# Altium schematic sheet STM32_CORE.SchDoc
size A4; SheetNumber: 2; SheetTotal: 4
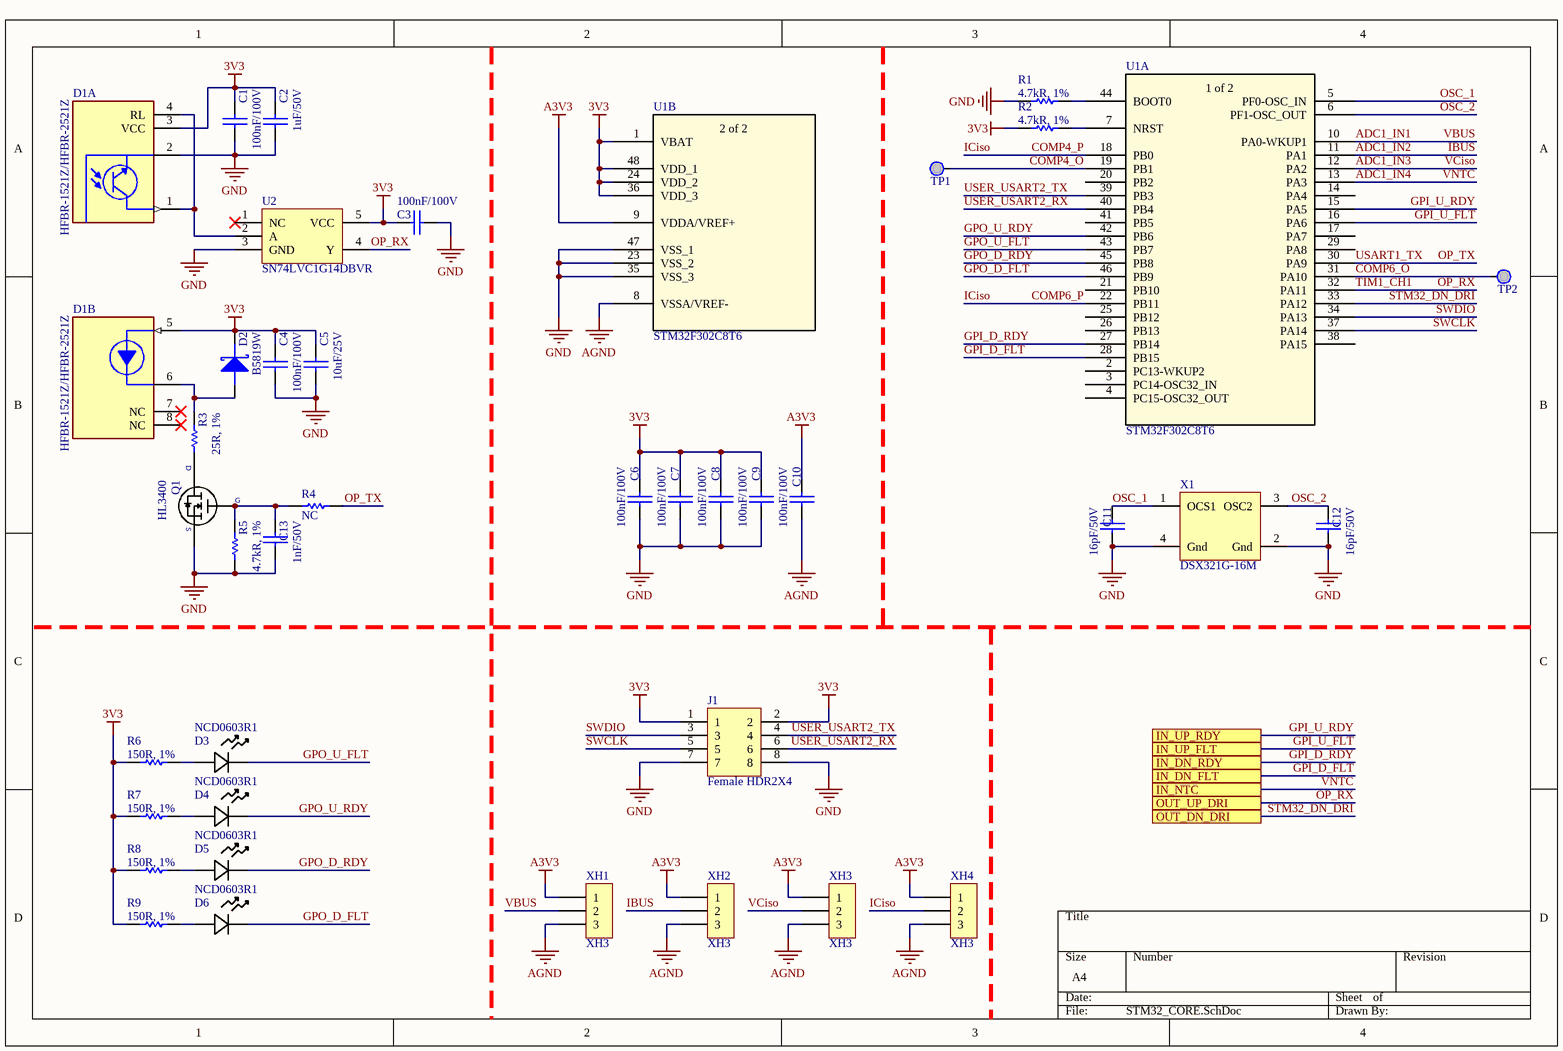
[diagram p0: STM32_CORE.SchDoc]

## Parts
C1  100nF/100V  [0603C]
C2  1uF/50V  [0603C]
C3  100nF/100V  [0603C]
C4  100nF/100V  [0603C]
C5  10uF/25V  [0603C]
C6  100nF/100V  [0603C]
C7  100nF/100V  [0603C]
C8  100nF/100V  [0603C]
C9  100nF/100V  [0603C]
C10  100nF/100V  [0603C]
C11  16pF/50V  [0603C]
C12  16pF/50V  [0603C]
C13  1nF/50V  [0603C]
D1  HFBR-1521Z/HFBR-2521Z  [HFBR_XX21Z_UNION]  (parts A,B of 2)
D2  B5819W  [SOD-123]
D3  NCD0603R1  [LED_LSQ976_OSR]
D4  NCD0603R1  [LED_LSQ976_OSR]
D5  NCD0603R1  [LED_LSQ976_OSR]
D6  NCD0603R1  [LED_LSQ976_OSR]
J1  Female HDR2X4  [Fe-HDR2X4/2.54-S]
Q1  HL3400  [SOT23-3]
R1  4.7kR, 1%  [0603R]
R2  4.7kR, 1%  [0603R]
R3  25R, 1%  [0603R]
R4  NC  [0603R]
R5  4.7kR, 1%  [0603R]
R6  150R, 1%  [0603R]
R7  150R, 1%  [0603R]
R8  150R, 1%  [0603R]
R9  150R, 1%  [0603R]
TP1  Test Point  [TP]  (value not drawn)  (no BOM)
TP2  Test Point  [TP]  (value not drawn)  (no BOM)
U1  STM32F302C8T6  [LQFP48-7x7mm]  (parts A,B of 2)
U2  SN74LVC1G14DBVR  [SOT23-5]
X1  DSX321G-16M  [SMD3225-4]
XH1  XH3  [XH3/2.54mm/180]
XH2  XH3  [XH3/2.54mm/180]
XH3  XH3  [XH3/2.54mm/180]
XH4  XH3  [XH3/2.54mm/180]

## Ports
IN_DN_FLT (see Top[2B]), IN_DN_RDY (see Top[2B]), IN_NTC (see Top[2B]), IN_UP_FLT (see Top[2A]), IN_UP_RDY (see Top[2A]), OUT_DN_DRI (see Top[2B]), OUT_UP_DRI (see Top[2B])

## Nets
3V3: C1.1 C2.2 C3.1 C4.1 C5.1 C6.1 C7.1 C8.1 C9.1 D1.3(VCC) D1.5(VO) D2.K J1.1 J1.2 R2.1 R6.1 R7.1 R8.1 R9.1 U1.1(VBAT) U1.24(VDD_2) U1.36(VDD_3) U1.48(VDD_1) U2.5(VCC)
A3V3: C10.1 U1.9(VDDA/VREF+) XH1.1 XH2.1 XH3.1 XH4.1
AGND: C10.2 U1.8(VSSA/VREF-) XH1.3 XH2.3 XH3.3 XH4.3
GND: C1.2 C2.1 C3.2 C4.2 C5.2 C6.2 C7.2 C8.2 C9.2 C11.1 C12.2 C13.1 D1.2(GROUND) J1.7 J1.8 Q1.2 R1.1 R5.1 U1.23(VSS_2) U1.35(VSS_3) U1.47(VSS_1) U2.3(GND) X1.2(Gnd) X1.4(Gnd)
ADC1_IN1: U1.10(PA0-WKUP1) XH1.2  [also labelled VBUS]
ADC1_IN2: U1.11(PA1) XH2.2  [also labelled IBUS]
ADC1_IN3: U1.12(PA2) XH3.2  [also labelled VCiso]
ADC1_IN4: U1.13(PA3) ; port IN_NTC  [also labelled VNTC]
COMP4_O: TP1.1 U1.19(PB1)
COMP4_P: U1.18(PB0) U1.22(PB11) XH4.2  [also labelled COMP6_P, ICiso]
COMP6_O: TP2.1 U1.31(PA10)
GPI_D_FLT: U1.28(PB15) ; port IN_DN_FLT
GPI_D_RDY: U1.27(PB14) ; port IN_DN_RDY
GPI_U_FLT: U1.16(PA6) ; port IN_UP_FLT
GPI_U_RDY: U1.15(PA5) ; port IN_UP_RDY
GPO_D_FLT: D6.1 U1.46(PB9)
GPO_D_RDY: D5.1 U1.45(PB8)
GPO_U_FLT: D3.1 U1.43(PB7)
GPO_U_RDY: D4.1 U1.42(PB6)
OP_RX: U1.32(PA11) U2.4(Y) ; port OUT_UP_DRI  [also labelled TIM1_CH1]
OP_TX: R4.1 U1.30(PA9)  [also labelled USART1_TX]
OSC_1: C11.2 U1.5(PF0-OSC_IN) X1.1(OCS1)
OSC_2: C12.1 U1.6(PF1-OSC_OUT) X1.3(OSC2)
STM32_DN_DRI: U1.33(PA12) ; port OUT_DN_DRI
SWCLK: J1.5 U1.37(PA14)
SWDIO: J1.3 U1.34(PA13)
USER_USART2_RX: J1.6 U1.40(PB4)
USER_USART2_TX: J1.4 U1.39(PB3)
NetC13_2: C13.2 Q1.1 R4.2 R5.2
NetD1_1: D1.1(VO) D1.4(RL) U2.2(A)
NetD1_6: D1.6(GROUND) D2.A R3.1
NetD3_2: D3.2 R6.2
NetD4_2: D4.2 R7.2
NetD5_2: D5.2 R8.2
NetD6_2: D6.2 R9.2
NetQ1_3: Q1.3 R3.2
NetR1_2: R1.2 U1.44(BOOT0)
NetR2_2: R2.2 U1.7(NRST)

Not connected (* = marked no-connect by the designer): D1 7(NC)* 8(NC)*; U1 2(PC13-WKUP2) 3(PC14-OSC32_IN) 4(PC15-OSC32_OUT) 14(PA4) 17(PA7) 20(PB2) 21(PB10) 25(PB12) 26(PB13) 29(PA8) 38(PA15) 41(PB5); U2 1(NC)*

## Notes on the sheet
- (in symbol NMOS) D; G; S
- (in symbol STM32F302C8T6, part A) 1 of 2
- (in symbol STM32F302C8T6, part B) 2 of 2

## Library data of the parts
C1 C3 C4 C6-C10 = CAP: CC0603KRX7R9BB104
C2 = CAP: CC0603KRX7R9BB105
C5 = CAP: CC0603MRX5R8BB106
C11 C12 = CAP: CC0603FRNPO9BN160
C13 = CAP: CC0603KRX7R9BB102
D1 = HFBR_XX21Z_UNION: Versatile Link Fiber-Optic Connection
D2 = DIODE SCHOTTKY
D3-D6 = LED: No Description Available; Manufacturer_Name: ams OSRAM; Manufacturer_Part_Number: LSQ976; Copyright: Copyright (C) 2025 Ultra Librarian. All rights reserved.
Q1 = NMOS
R1 R2 R5 = RES: RC0603FR-074K7L
R3 = RES: RP0603BRD0725RL
R4 = RES
R6-R9 = RES: RC0603FR-07150RL
TP1 TP2 = TP
U1 = STM32F302C8T6: Mainstream Mixed signals MCUs Arm Cortex-M4 core with DSP and FPU, 64 Kbytes of Flash memory, 72 MHz CPU, 12-bit ADC 5 MSPS, Comparator, Op-Amp; Manufacturer_Name: STMicroelectronics; Copyright: Copyright (C) 2025 Ultra Librarian. All rights reserved.; Manufacturer_Part_Number: STM32F302C8T6; Datasheet: https://www.st.com/resource/en/datasheet/stm32f302r6.pdf; RefDes: RefDes; Type: Type
U2 = SN74LVC1G14DBVR: Y=A\
X1 = DSX321G-16M: 无源晶振